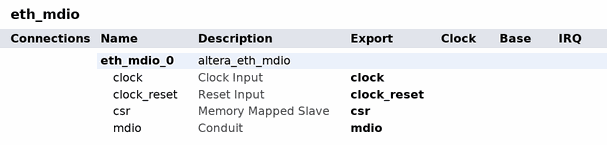
[diagram p0: system contents]
# Platform Designer (Qsys) system eth_mdio, Cyclone IV E EP4CE115F29C7
# Parameters at their usual value, and those the tool derives, are not listed.
package require -exact qsys 18.0
create_system eth_mdio
set_project_property DEVICE_FAMILY {Cyclone IV E}
set_project_property DEVICE EP4CE115F29C7

add_instance eth_mdio_0 altera_eth_mdio 18.0
set_instance_property eth_mdio_0 AUTO_EXPORT true
set_instance_parameter_value eth_mdio_0 MDC_DIVISOR 50

# exported interfaces
add_interface clock clock sink
set_interface_property clock EXPORT_OF eth_mdio_0.clock
add_interface clock_reset reset sink
set_interface_property clock_reset EXPORT_OF eth_mdio_0.clock_reset
add_interface csr avalon slave
set_interface_property csr EXPORT_OF eth_mdio_0.csr
add_interface mdio conduit end
set_interface_property mdio EXPORT_OF eth_mdio_0.mdio

set_interconnect_requirement {$system} qsys_mm.clockCrossingAdapter HANDSHAKE
set_interconnect_requirement {$system} qsys_mm.enableEccProtection FALSE
set_interconnect_requirement {$system} qsys_mm.insertDefaultSlave FALSE
set_interconnect_requirement {$system} qsys_mm.maxAdditionalLatency 1

save_system eth_mdio.qsys
